# Altium schematic sheet Bodem_Sch.SchDoc
size A
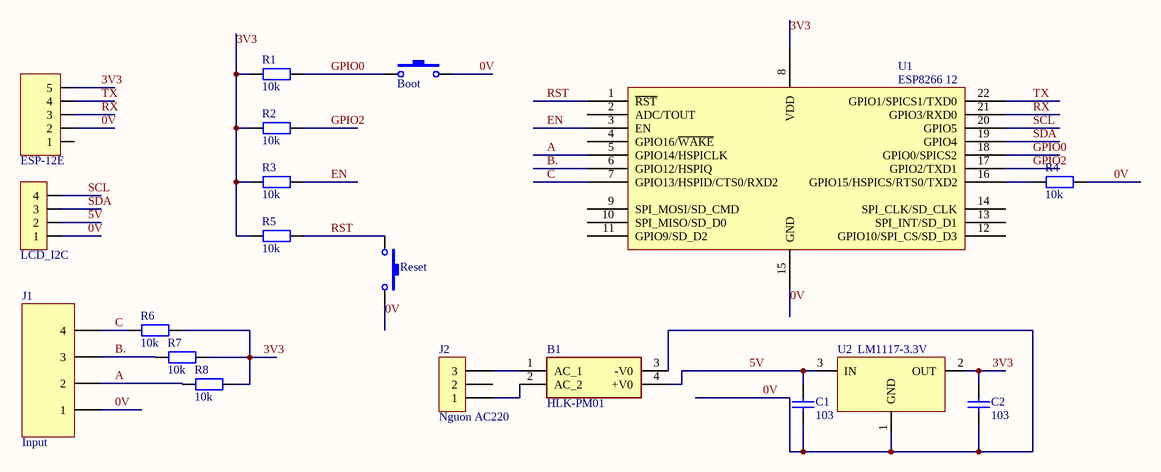
[diagram p0: Bodem_Sch.SchDoc]

## Parts
B1  HLK-PM01  [HLKPM01]
Boot  Nut Nhan 2 Chan SMD 3x6x2.5  [Nut Nhan 2 Chan SMD 3x6x2.5]  (value not drawn)
C1  103  [tu 0603]
C2  103  [tu 0603]
J1  Input  [KF4-7.62]
J2  Nguon AC220  [KF3-7.62]
JP1  ESP-12E  [JP 1x5 CT]
JP2  LCD_I2C  [JP 1x4 DT]
R1  10k  [tro smd 0603]
R2  10k  [tro smd 0603]
R3  10k  [tro smd 0603]
R4  10k  [tro smd 0603]
R5  10k  [tro smd 0603]
R6  10k  [tro smd 0603]
R7  10k  [tro smd 0603]
R8  10k  [tro smd 0603]
Reset  Nut Nhan 2 Chan SMD 3x6x2.5  [Nut Nhan 2 Chan SMD 3x6x2.5]  (value not drawn)
U1  ESP8266 12  [ESP8266 12]
U2  LM1117-3.3V  [SOT223]

## Nets
0V: B1.3(-V0) Boot.2 C1.2 C2.2 J1.1 JP1.2 JP2.1 R4.2 Reset.2 U1.15(GND) U2.1(GND)
3V3: C2.1 JP1.5 R1.1 R2.1 R3.1 R5.1 R6.2 R7.2 R8.2 U1.8(VDD) U2.2(OUT)
5V: B1.4(+V0) C1.1 JP2.2 U2.3(IN)
A: J1.2 R8.1 U1.5(GPIO14/HSPICLK)
B.: J1.3 R7.1 U1.6(GPIO12/HSPIQ)
C: J1.4 R6.1 U1.7(GPIO13/HSPID/CTS0/RXD2)
EN: R3.2 U1.3(EN)
GPIO0: Boot.1 R1.2 U1.18(GPIO0/SPICS2)
GPIO2: R2.2 U1.17(GPIO2/TXD1)
RST: R5.2 Reset.1 U1.1(~{RST})
RX: JP1.3 U1.21(GPIO3/RXD0)
SCL: JP2.4 U1.20(GPIO5)
SDA: JP2.3 U1.19(GPIO4)
TX: JP1.4 U1.22(GPIO1/SPICS1/TXD0)
NetB1_1: B1.1(AC_1) J2.3
NetB1_2: B1.2(AC_2) J2.1
NetR4_1: R4.1 U1.16(GPIO15/HSPICS/RTS0/TXD2)

Not connected (* = marked no-connect by the designer): J2 2; JP1 1; U1 2(ADC/TOUT) 4(GPIO16/~{WAKE}) 9(SPI_MOSI/SD_CMD) 10(SPI_MISO/SD_D0) 11(GPIO9/SD_D2) 12(GPIO10/SPI_CS/SD_D3) 13(SPI_INT/SD_D1) 14(SPI_CLK/SD_CLK)

## Library data of the parts
B1 = HLK-PM01: Ultra-compact power module; Manufacturer_Name: Hi-Link; Geometry.Height: 15mm; Manufacturer_Part_Number: HLK-PM01; Mouser Part Number: *; Mouser Price/Stock: *; Arrow Part Number: *; Arrow Price/Stock: *; Datasheet Link: https://datasheet.lcsc.com/szlcsc/1906201102_HI-LINK-HLK-PM03_C209904.pdf
Boot Reset = Nut Nhan 2 Chan SMD 3x6x2.5: Ma_Hang: MH001036; Ten: Nút Nhấn 2 Chân 3x6x2.5MM SMD
C1 C2 = Tu 0603 103 50V 10%: Dán; Don_Vi: Con; So_Chan: 2; Ten_Linh_Kien: Tụ 0603 103-10nF 10% 50V; Ma_Hang: MH004567; Chung_Loai: Dán; Kieu_Chan: *
J1 = KF4: Manufacturer: W¨¹rth Elektronik eiSos GmbH; PartNo: 691133710004; ComponentLink1 Description: Manufacturer; ComponentLink2 Description: Datasheet; NoPins: 4; ComponentLink1 URL: http://www.we-online.com; ComponentLink2 URL: http://katalog.we-online.de/em/datasheet/6911337100xx.pdf; Created By: Baojun Chen; Created Date: 4-Aug-15
J2 = KF3: Manufacturer: Würth Elektronik eiSos GmbH; partNo: 691103110003; ComponentLink1 Description: Manufacturer; ComponentLink2 Description: Datasheet; NoPins: 3; Created Date: 29 October 2013; ComponentLink1URL: http://www.we-online.com; ComponentLink2URL: http://katalog.we-online.de/em/datasheet/6911031100xx.pdf; Created by: Karrer Zheng
JP1 = JP 1x5 2.54 Cai Thang: Cắm; Ten_Linh_Kien: Jump Đơn Cái 2.54MM 1x20P Thẳng; Don_Vi: Con; Ma_Hang: MH004006; Ghi_Chu: *; Kieu_Chan: *; Chung_Loai: Cắm
JP2 = JP 1x4 2.54 Duc Thang: Cắm; Ten_Linh_Kien: Jump Đơn Đực 2.54MM 1x40P Thẳng 11MM; Don_Vi: Con; Ma_Hang: MH000903; Ghi_Chu: *; Kieu_Chan: *; Chung_Loai: Cắm
R1-R8 = Tro 0603 5% 10k: Dán; Don_Vi: Con; So_Chan: 2; Ten_Linh_Kien: Trở 0603 5% 10k; Ma_Hang: MH006316; Chung_Loai: Dán; Kieu_Chan: *
U1 = ESP8266 12: ESP8266 12 22 Pin; IC: ESP8266-EX; Vendor: Ai-thinker
U2 = LM1117: 800mA Low-Dropout Linear Regulator; Creator: Nguyen Ba Bien; Website: http://group3i.net